# EAGLE design BelaCore (EAGLE 7.5.0)
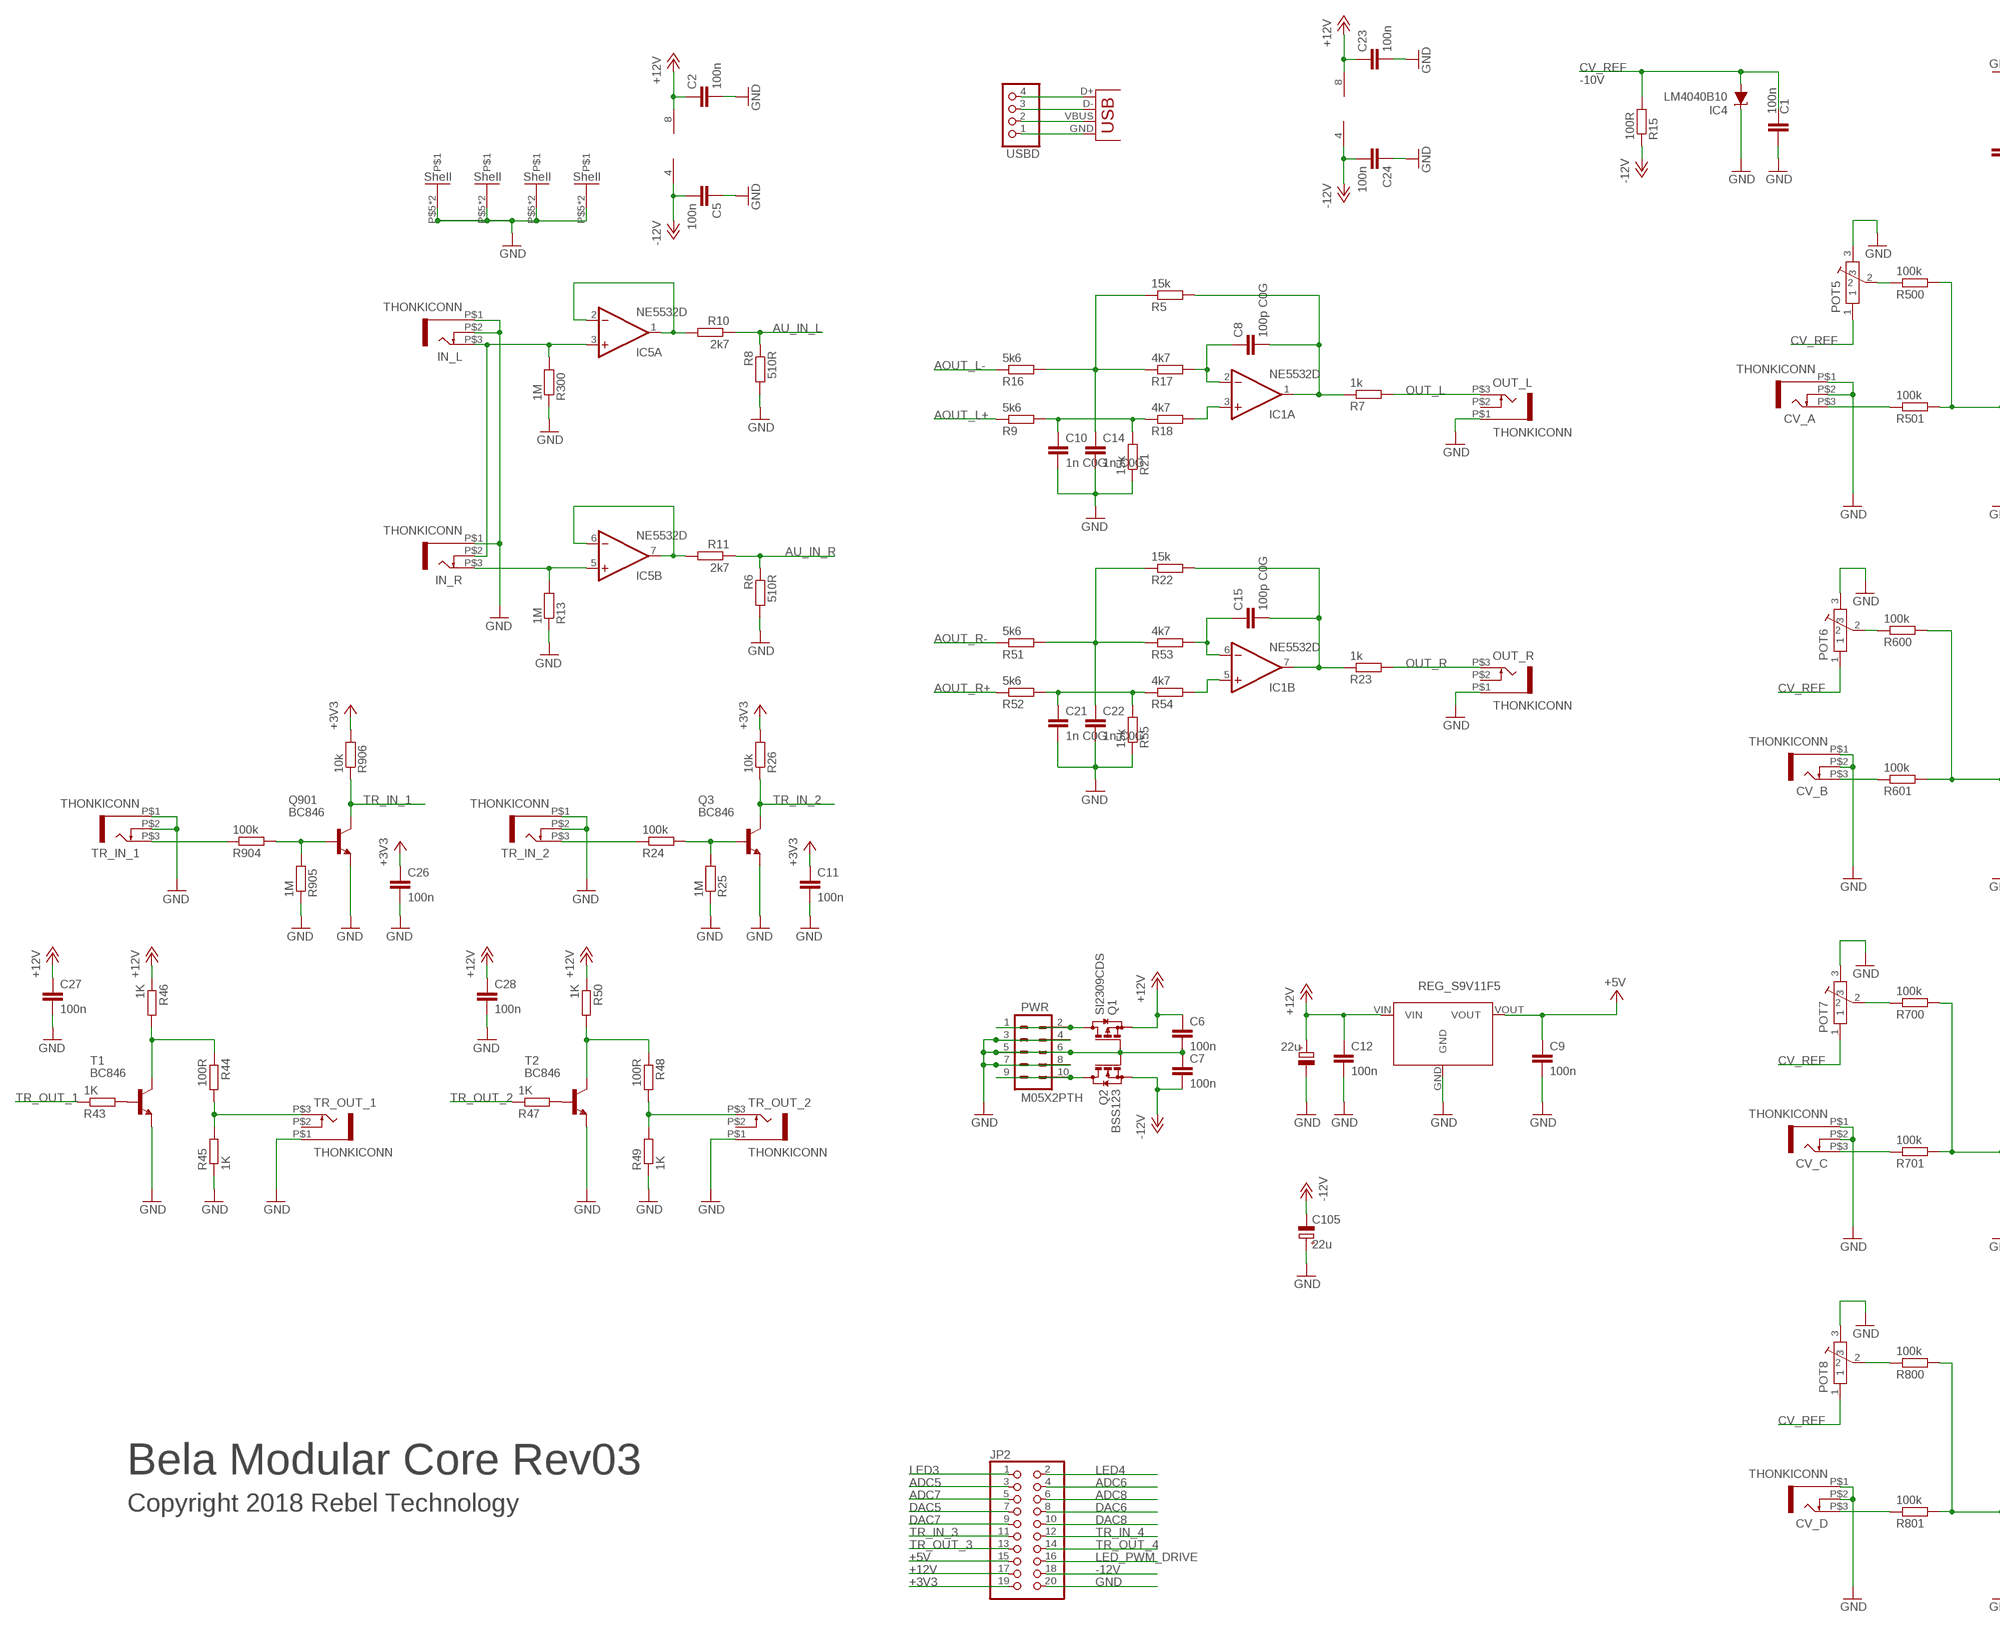
[diagram p0: schematic, sheet 1, part 1 of 2]
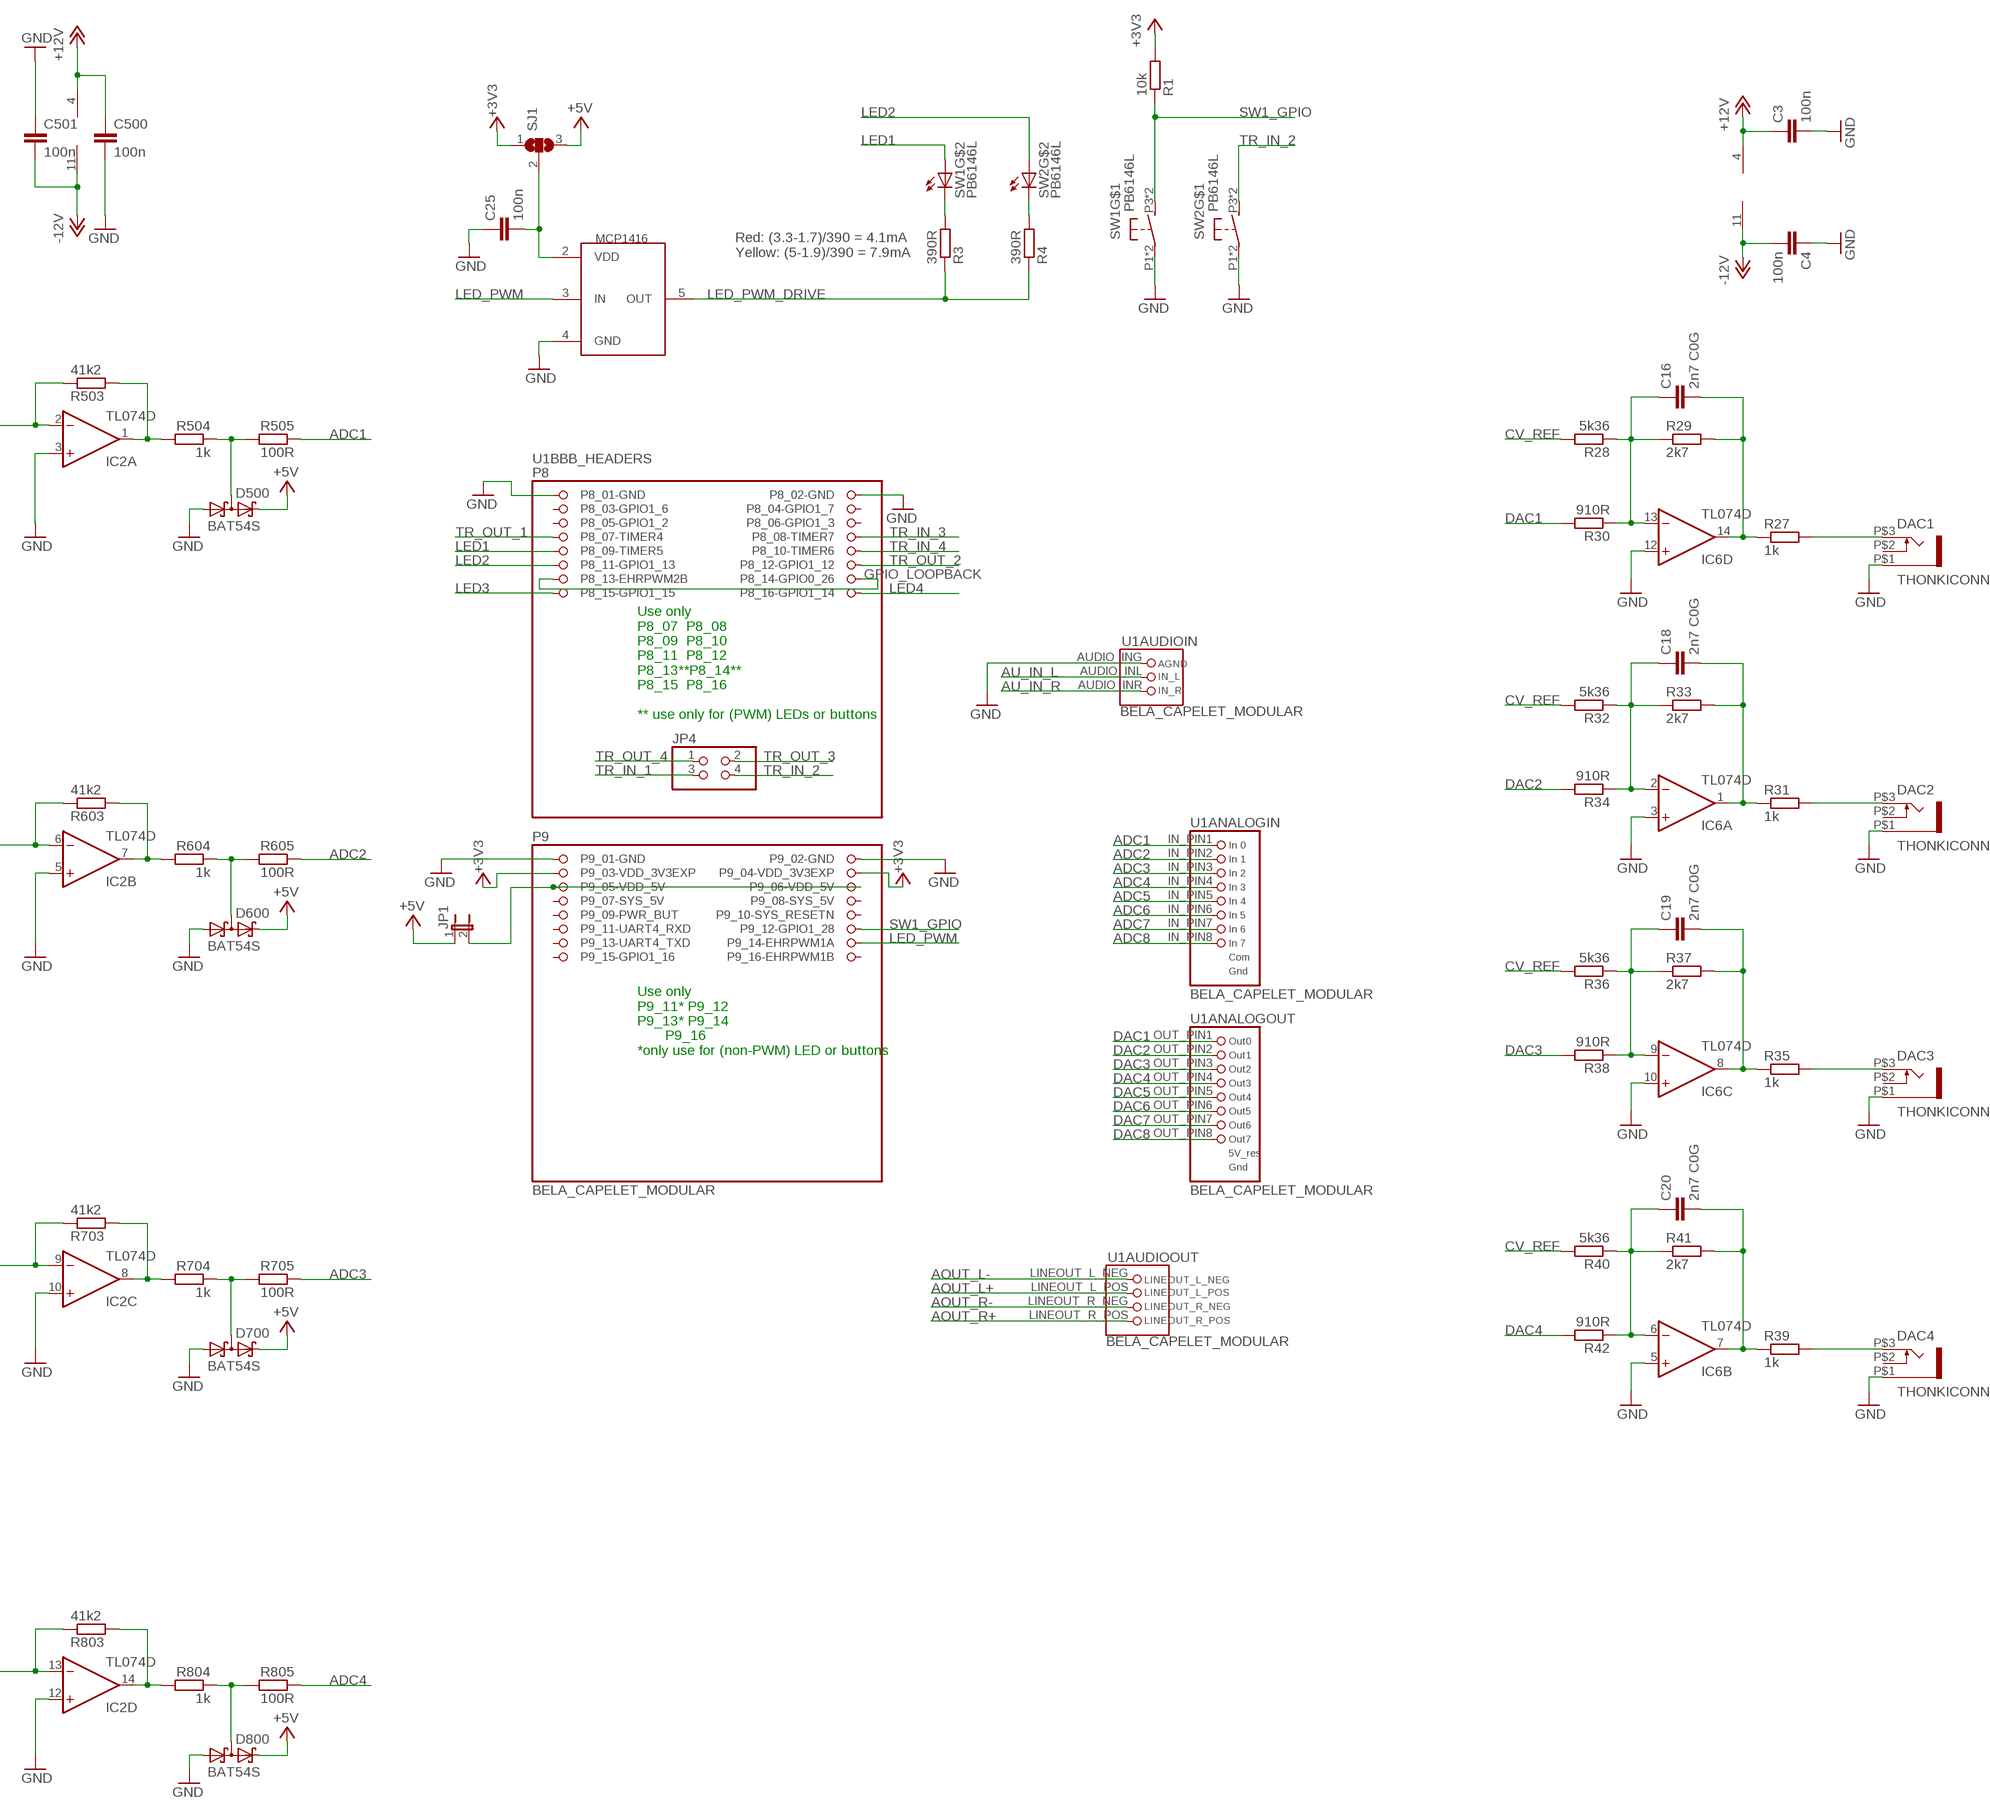
[diagram p1: schematic, sheet 1, part 2 of 2]

## Parts
C1  100n  C-EUC0603  [C0603]
C2  100n  C-EUC0603  [C0603]
C3  100n  C-EUC0603  [C0603]
C4  100n  C-EUC0603  [C0603]
C5  100n  C-EUC0603  [C0603]
C6  100n  C-EUC0603  [C0603]
C7  100n  C-EUC0603  [C0603]
C8  100p C0G  C-EUC0603  [C0603]
C9  100n  C-EUC0603  [C0603]
C10  1n C0G  C-EUC0603  [C0603]
C11  100n  C-EUC0603  [C0603]
C12  100n  C-EUC0603  [C0603]
C14  1n C0G  C-EUC0603  [C0603]
C15  100p C0G  C-EUC0603  [C0603]
C16  2n7 C0G  C-EUC0603  [C0603]
C17  22u  CPOL-EU153CLV-0505  [CPOL-5]
C18  2n7 C0G  C-EUC0603  [C0603]
C19  2n7 C0G  C-EUC0603  [C0603]
C20  2n7 C0G  C-EUC0603  [C0603]
C21  1n C0G  C-EUC0603  [C0603]
C22  1n C0G  C-EUC0603  [C0603]
C23  100n  C-EUC0603  [C0603]
C24  100n  C-EUC0603  [C0603]
C25  100n  C-EUC0603  [C0603]
C26  100n  C-EUC0603  [C0603]
C27  100n  C-EUC0603  [C0603]
C28  100n  C-EUC0603  [C0603]
C105  22u  CPOL-EU153CLV-0505  [CPOL-5]
C500  100n  C-EUC0603  [C0603]
C501  100n  C-EUC0603  [C0603]
CV_A  THONKICONN  [THONKICONN]
CV_B  THONKICONN  [THONKICONN]
CV_C  THONKICONN  [THONKICONN]
CV_D  THONKICONN  [THONKICONN]
D500  BAT54S  [SOT23]
D600  BAT54S  [SOT23]
D700  BAT54S  [SOT23]
D800  BAT54S  [SOT23]
DAC1  THONKICONN  [THONKICONN]
DAC2  THONKICONN  [THONKICONN]
DAC3  THONKICONN  [THONKICONN]
DAC4  THONKICONN  [THONKICONN]
IC1  NE5532D  [SO08]
IC2  TL074D  [SO14]
IC4  LM4040B10  LM4041C12DBZ  [DBZ_R-PDSO-G3]
IC5  NE5532D  [SO08]
IC6  TL074D  [SO14]
IN_L  THONKICONN  [THONKICONN]
IN_R  THONKICONN  [THONKICONN]
JP1  JUMPER-2PTH  [1X02]
JP2  PINHD-2X10  [2X10]
JP4  PINHD-2X02_2.54-SMD  [2X02SMD]
OUT_L  THONKICONN  [THONKICONN]
OUT_R  THONKICONN  [THONKICONN]
POT5  POT-ALPS-RK09L1140  [POT-ALPS-RK09L1140]
POT6  POT-ALPS-RK09L1140  [POT-ALPS-RK09L1140]
POT7  POT-ALPS-RK09L1140  [POT-ALPS-RK09L1140]
POT8  POT-ALPS-RK09L1140  [POT-ALPS-RK09L1140]
PWR  M05X2PTH  [AVR_ICSP]
Q1  SI2309CDS  BSS84  [SOT23]
Q2  BSS123  [SOT23]
Q3  BC846  [SOT23]
Q901  BC846  [SOT23]
R1  10k  R-EU_0603  [0603]
R3  390R  R-EU_0603  [0603]
R4  390R  R-EU_0603  [0603]
R5  15k  R-EU_0603  [0603]
R6  510R  R-EU_0603  [0603]
R7  1k  R-EU_0603  [0603]
R8  510R  R-EU_0603  [0603]
R9  5k6  R-EU_0603  [0603]
R10  2k7  R-EU_0603  [0603]
R11  2k7  R-EU_0603  [0603]
R13  1M  R-EU_0603  [0603]
R15  100R  R-EU_0603  [0603]
R16  5k6  R-EU_0603  [0603]
R17  4k7  R-EU_0603  [0603]
R18  4k7  R-EU_0603  [0603]
R21  15k  R-EU_0603  [0603]
R22  15k  R-EU_0603  [0603]
R23  1k  R-EU_0603  [0603]
R24  100k  R-EU_0603  [0603]
R25  1M  R-EU_0603  [0603]
R26  10k  R-EU_0603  [0603]
R27  1k  R-EU_0603  [0603]
R28  5k36  R-EU_0603  [0603]
R29  2k7  R-EU_0603  [0603]
R30  910R  R-EU_0603  [0603]
R31  1k  R-EU_0603  [0603]
R32  5k36  R-EU_0603  [0603]
R33  2k7  R-EU_0603  [0603]
R34  910R  R-EU_0603  [0603]
R35  1k  R-EU_0603  [0603]
R36  5k36  R-EU_0603  [0603]
R37  2k7  R-EU_0603  [0603]
R38  910R  R-EU_0603  [0603]
R39  1k  R-EU_0603  [0603]
R40  5k36  R-EU_0603  [0603]
R41  2k7  R-EU_0603  [0603]
R42  910R  R-EU_0603  [0603]
R43  1K  R-EU_0603  [0603]
R44  100R  R-EU_0603  [0603]
R45  1K  R-EU_0603  [0603]
R46  1K  R-EU_0603  [0603]
R47  1K  R-EU_0603  [0603]
R48  100R  R-EU_0603  [0603]
R49  1K  R-EU_0603  [0603]
R50  1K  R-EU_0603  [0603]
R51  5k6  R-EU_0603  [0603]
R52  5k6  R-EU_0603  [0603]
R53  4k7  R-EU_0603  [0603]
R54  4k7  R-EU_0603  [0603]
R55  15k  R-EU_0603  [0603]
R300  1M  R-EU_0603  [0603]
R500  100k  R-EU_0603  [0603]
R501  100k  R-EU_0603  [0603]
R503  41k2  R-EU_0603  [0603]
R504  1k  R-EU_0603  [0603]
R505  100R  R-EU_0603  [0603]
R600  100k  R-EU_0603  [0603]
R601  100k  R-EU_0603  [0603]
R603  41k2  R-EU_0603  [0603]
R604  1k  R-EU_0603  [0603]
R605  100R  R-EU_0603  [0603]
R700  100k  R-EU_0603  [0603]
R701  100k  R-EU_0603  [0603]
R703  41k2  R-EU_0603  [0603]
R704  1k  R-EU_0603  [0603]
R705  100R  R-EU_0603  [0603]
R800  100k  R-EU_0603  [0603]
R801  100k  R-EU_0603  [0603]
R803  41k2  R-EU_0603  [0603]
R804  1k  R-EU_0603  [0603]
R805  100R  R-EU_0603  [0603]
R904  100k  R-EU_0603  [0603]
R905  1M  R-EU_0603  [0603]
R906  10k  R-EU_0603  [0603]
SJ1  SJ2W  [SJ_2]
SW1  PB6146L  [PB6146L]
SW2  PB6146L  [PB6146L]
T1  BC846  [SOT23]
T2  BC846  [SOT23]
TR_IN_1  THONKICONN  [THONKICONN]
TR_IN_2  THONKICONN  [THONKICONN]
TR_OUT_1  THONKICONN  [THONKICONN]
TR_OUT_2  THONKICONN  [THONKICONN]
U1  BELA_CAPELET_MODULAR  [BELA_CAPELET_MODULAR]
U2  MCP1416  [SOT23-5]
U3  REG_S9V11F5  [REG_S9V11F5]
USBD  PINHD-1X4  [1X04]
X1  USBPTH-VERTICAL  [USB-B-PTH-VERTICAL]

## Nets
+3V3: C11.1 C26.1 JP2.19 R1.2 R26.2 R906.2 SJ1.1 U1.P9_03(BBB_HEADERS:P9_03-VDD_3V3EXP) U1.P9_04(BBB_HEADERS:P9_04-VDD_3V3EXP)
+5V: C9.1 D500.2(C2) D600.2(C2) D700.2(C2) D800.2(C2) JP1.1 JP2.15 SJ1.3 U3.VOUT
+12V: C2.1 C3.1 C6.1 C12.1 C17.+ C23.1 C27.1 C28.1 C500.1 IC1.8(P:V+) IC2.4(P:V+) IC5.8(P:V+) IC6.4(P:V+) JP2.17 Q1.2(S) R46.1 R50.1 U3.VIN
-12V: C4.2 C5.2 C7.2 C24.2 C105.- C501.2 IC1.4(P:V-) IC2.11(P:V-) IC5.4(P:V-) IC6.11(P:V-) JP2.18 Q2.2(S) R15.1
ADC1: R505.1 U1.IN_PIN1
ADC2: R605.1 U1.IN_PIN2
ADC3: R705.1 U1.IN_PIN3
ADC4: R805.1 U1.IN_PIN4
ADC5: JP2.3 U1.IN_PIN5
ADC6: JP2.4 U1.IN_PIN6
ADC7: JP2.5 U1.IN_PIN7
ADC8: JP2.6 U1.IN_PIN8
AOUT_L+: R9.1 U1.LINEOUT_L_POS
AOUT_L-: R16.1 U1.LINEOUT_L_NEG
AOUT_R+: R52.1 U1.LINEOUT_R_POS
AOUT_R-: R51.1 U1.LINEOUT_R_NEG
AU_IN_L: R8.1 R10.1 U1.AUDIO_INL
AU_IN_R: R6.1 R11.1 U1.AUDIO_INR
CV_REF: C1.1 IC4.2(A) POT5.1 POT6.1 POT7.1 POT8.1 R15.2 R28.2 R32.2 R36.2 R40.2
DAC1: R30.2 U1.OUT_PIN1
DAC2: R34.2 U1.OUT_PIN2
DAC3: R38.2 U1.OUT_PIN3
DAC4: R42.2 U1.OUT_PIN4
DAC5: JP2.7 U1.OUT_PIN5
DAC6: JP2.8 U1.OUT_PIN6
DAC7: JP2.9 U1.OUT_PIN7
DAC8: JP2.10 U1.OUT_PIN8
GND: C1.2 C2.2 C3.2 C4.1 C5.1 C6.2 C7.1 C9.2 C10.2 C11.2 C12.2 C14.2 C17.- C21.2 C22.2 C23.2 C24.1 C25.1 C26.2 C27.2 C28.2 C105.+ C500.2 C501.1 CV_A.P$1 CV_A.P$2 CV_B.P$1 CV_B.P$2 CV_C.P$1 CV_C.P$2 CV_D.P$1 CV_D.P$2 D500.1(A1) D600.1(A1) D700.1(A1) D800.1(A1) DAC1.P$1 DAC2.P$1 DAC3.P$1 DAC4.P$1 IC2.3(A:+IN) IC2.5(B:+IN) IC2.10(C:+IN) IC2.12(D:+IN) IC4.1(C) IC6.3(A:+IN) IC6.5(B:+IN) IC6.10(C:+IN) IC6.12(D:+IN) IN_L.P$1 IN_L.P$2 IN_R.P$1 JP2.20 OUT_L.P$1 OUT_R.P$1 POT5.3 POT5.P$5 POT5.P$6 POT6.3 POT6.P$5 POT6.P$6 POT7.3 POT7.P$5 POT7.P$6 POT8.3 POT8.P$5 POT8.P$6 PWR.3 PWR.4 PWR.5 PWR.6 PWR.7 PWR.8 Q1.1(G) Q2.1(G) Q3.2(E) Q901.2(E) R6.2 R8.2 R13.1 R21.1 R25.1 R45.1 R49.1 R55.1 R300.1 R905.1 SW1.P1(P) SW1.P2(P) SW2.P1(P) SW2.P2(P) T1.2(E) T2.2(E) TR_IN_1.P$1 TR_IN_1.P$2 TR_IN_2.P$1 TR_IN_2.P$2 TR_OUT_1.P$1 TR_OUT_2.P$1 U1.AUDIO_ING U1.P8_01(BBB_HEADERS:P8_01-GND) U1.P8_02(BBB_HEADERS:P8_02-GND) U1.P9_01(BBB_HEADERS:P9_01-GND) U1.P9_02(BBB_HEADERS:P9_02-GND) U2.4(GND) U3.GND
GPIO_LOOPBACK: U1.P8_13(BBB_HEADERS:P8_13-EHRPWM2B) U1.P8_14(BBB_HEADERS:P8_14-GPIO0_26)
IN_L: IC5.3(A:+IN) IN_L.P$3 IN_R.P$2 R300.2
LED1: SW1.PL1(A) U1.P8_09(BBB_HEADERS:P8_09-TIMER5)
LED2: SW2.PL1(A) U1.P8_11(BBB_HEADERS:P8_11-GPIO1_13)
LED3: JP2.1 U1.P8_15(BBB_HEADERS:P8_15-GPIO1_15)
LED4: JP2.2 U1.P8_16(BBB_HEADERS:P8_16-GPIO1_14)
LED_PWM: U1.P9_14(BBB_HEADERS:P9_14-EHRPWM1A) U2.3(IN)
LED_PWM_DRIVE: JP2.16 R3.1 R4.1 U2.5(OUT)
N$1: IC5.6(B:-IN) IC5.7(B:OUT) R11.2
N$2: IC5.1(A:OUT) IC5.2(A:-IN) R10.2
N$3: CV_A.P$3 R501.1
N$4: JP1.2 U1.P9_05(BBB_HEADERS:P9_05-VDD_5V) U1.P9_06(BBB_HEADERS:P9_06-VDD_5V)
N$5: R3.2 SW1.PL2(C)
N$6: IC2.9(C:-IN) R700.2 R701.2 R703.1
N$7: C25.2 SJ1.2 U2.2(VDD)
N$8: PWR.9 PWR.10 Q2.3(D)
N$9: R4.2 SW2.PL2(C)
N$10: C8.2 IC1.1(A:OUT) R5.2 R7.1
N$11: C8.1 IC1.2(A:-IN) R17.2
N$12: PWR.1 PWR.2 Q1.3(D)
N$13: IC2.2(A:-IN) R500.2 R501.2 R503.1
N$14: POT5.2 R500.1
N$15: IC1.3(A:+IN) R18.2
N$16: D500.3(C1A2) R504.1 R505.2
N$17: IC2.1(A:OUT) R503.2 R504.2
N$19: CV_B.P$3 R601.1
N$20: IC2.6(B:-IN) R600.2 R601.2 R603.1
N$21: POT6.2 R600.1
N$22: IC2.7(B:OUT) R603.2 R604.2
N$23: D600.3(C1A2) R604.1 R605.2
N$24: C10.1 R9.2 R18.1 R21.2
N$25: CV_C.P$3 R701.1
N$27: POT7.2 R700.1
N$28: IC2.8(C:OUT) R703.2 R704.2
N$29: D700.3(C1A2) R704.1 R705.2
N$30: C15.2 IC1.7(B:OUT) R22.2 R23.1
N$31: CV_D.P$3 R801.1
N$32: C22.1 R22.1 R51.2 R53.1
N$33: IC2.13(D:-IN) R800.2 R801.2 R803.1
N$34: POT8.2 R800.1
N$35: IC2.14(D:OUT) R803.2 R804.2
N$36: D800.3(C1A2) R804.1 R805.2
N$37: Q901.1(B) R904.2 R905.2
N$38: R43.2 T1.1(B)
N$40: C15.1 IC1.6(B:-IN) R53.2
N$41: C14.1 R5.1 R16.2 R17.1
N$42: IC1.5(B:+IN) R54.2
N$43: C21.1 R52.2 R54.1 R55.2
N$44: R44.1 R46.2 T1.3(C)
N$45: Q3.1(B) R24.2 R25.2
N$46: R904.1 TR_IN_1.P$3
N$47: R24.1 TR_IN_2.P$3
N$48: IC5.5(B:+IN) IN_R.P$3 R13.2
N$49: C16.2 IC6.14(D:OUT) R27.1 R29.2
N$50: C16.1 IC6.13(D:-IN) R28.1 R29.1 R30.1
N$51: DAC1.P$3 R27.2
N$52: C18.2 IC6.1(A:OUT) R31.1 R33.2
N$53: C18.1 IC6.2(A:-IN) R32.1 R33.1 R34.1
N$54: DAC2.P$3 R31.2
N$55: C19.2 IC6.8(C:OUT) R35.1 R37.2
N$56: C19.1 IC6.9(C:-IN) R36.1 R37.1 R38.1
N$57: DAC3.P$3 R35.2
N$58: C20.2 IC6.7(B:OUT) R39.1 R41.2
N$59: C20.1 IC6.6(B:-IN) R40.1 R41.1 R42.1
N$60: DAC4.P$3 R39.2
N$61: R44.2 R45.2 TR_OUT_1.P$3
N$62: R47.2 T2.1(B)
N$63: R48.1 R50.2 T2.3(C)
N$64: R48.2 R49.2 TR_OUT_2.P$3
N$65: USBD.4 X1.D+
N$66: USBD.1 X1.GND
N$67: USBD.2 X1.VBUS
N$68: USBD.3 X1.D-
OUT_L: OUT_L.P$3 R7.2
OUT_R: OUT_R.P$3 R23.2
SW1_GPIO: R1.1 SW1.P3(S) SW1.P4(S) U1.P9_12(BBB_HEADERS:P9_12-GPIO1_28)
TR_IN_1: JP4.3 Q901.3(C) R906.1
TR_IN_2: JP4.4 Q3.3(C) R26.1 SW2.P3(S) SW2.P4(S)
TR_IN_3: JP2.11 U1.P8_08(BBB_HEADERS:P8_08-TIMER7)
TR_IN_4: JP2.12 U1.P8_10(BBB_HEADERS:P8_10-TIMER6)
TR_OUT_1: R43.1 U1.P8_07(BBB_HEADERS:P8_07-TIMER4)
TR_OUT_2: R47.1 U1.P8_12(BBB_HEADERS:P8_12-GPIO1_12)
TR_OUT_3: JP2.13 JP4.2
TR_OUT_4: JP2.14 JP4.1
Unconnected: DAC1.P$2 DAC2.P$2 DAC3.P$2 DAC4.P$2 OUT_L.P$2 OUT_R.P$2 TR_OUT_1.P$2 TR_OUT_2.P$2 U1.P8_03(BBB_HEADERS:P8_03-GPIO1_6) U1.P8_04(BBB_HEADERS:P8_04-GPIO1_7) U1.P8_05(BBB_HEADERS:P8_05-GPIO1_2) U1.P8_06(BBB_HEADERS:P8_06-GPIO1_3) U1.P9_08(BBB_HEADERS:P9_08-SYS_5V) U1.P9_09(BBB_HEADERS:P9_09-PWR_BUT) U1.P9_10(BBB_HEADERS:P9_10-SYS_RESETN) U1.P9_11(BBB_HEADERS:P9_11-UART4_RXD) U1.P9_13(BBB_HEADERS:P9_13-UART4_TXD) U1.P9_15(BBB_HEADERS:P9_15-GPIO1_16) U1.P9_16(BBB_HEADERS:P9_16-EHRPWM1B)

## Notes on the sheet
- -10V
- Red: (3.3-1.7)/390 = 4.1mA
  Yellow: (5-1.9)/390 = 7.9mA
- Use only 
  P8_07  P8_08
  P8_09  P8_10
  P8_11  P8_12
  P8_13**P8_14**
  P8_15  P8_16
  
  ** use only for (PWM) LEDs or buttons
- Use only
  P9_11* P9_12
  P9_13* P9_14
         P9_16
  *only use for (non-PWM) LED or buttons
- Bela Modular Core Rev03
- Copyright 2018 Rebel Technology

## Power pins joined to a net without a drawn wire
P9_07-SYS_5V: U1.P9_07(BBB_HEADERS:P9_07-SYS_5V)

## Library data of the parts
C1-C8 C10 C11 C14 C15 C21-C24 C26-C28 C500 C501 = resistor:C-EU: CAPACITOR, European symbol
C9 C12 C16 C18-C20 C25 = Rebel:C-EU: CAPACITOR, European symbol
C17 C105 = Rebel:CPOL-EU: POLARIZED CAPACITOR, European symbol
CV_A CV_B CV_C CV_D DAC1-DAC4 IN_L IN_R OUT_L OUT_R TR_IN_1 TR_IN_2 TR_OUT_1 TR_OUT_2 = Rebel:THONKICONN
D500 D600 D700 D800 = diode:BAT54S: Schottky Diodes Pin connection corrected 2011-05-04 Source: Fairchild .. BAT54.pdf
IC1 IC5 = linear:NE5532: AUDIO AMPLIFIER
IC2 IC6 = linear:TL074: OP AMP
IC4 = texas:LM4041: PRECISION MICROPOWER SHUNT VOLTAGE REFERENCE Source: http://focus.ti.com/lit/ds/slcs146e/slcs146e.pdf; MF: TEXAS INSTRUMENT CONNECTORS; MPN: LM4041C12QDBZT; OC_FARNELL: 1771733; OC_NEWARK: 43K3376
JP1 = SparkFun-Retired:JUMPER-2: Jumper Basic 0.1" spaced jumper. Use with breakaway headers.
JP2 = pinhead:PINHD-2X10: PIN HEADER
JP4 = bela_capelet - Rebel Modified:PINHD-2X02: PIN HEADER
POT5-POT8 = Rebel:POT-ALPS-RK09L
PWR = SparkFun:M05X2: Header 5x2 Standard 10-pin dual row 0.1" header. Commonly used with AVR-ISP. Use with Spark Fun Electronics SKU: PRT-00778
Q1 = transistor-small-signal:BSS84: P-CHANNEL MOS FET; OC_FARNELL: 1779264
Q2 = transistor-small-signal:BSS123: N-CHANNEL MOS FET; OC_FARNELL: 1843725
Q3 Q901 T1 T2 = transistor:BC846: NPN TRANSISTOR
R1 R3-R11 R13 R15-R18 R21-R55 R300 R500 R501 R503-R505 R600 R601 R603-R605 R700 R701 R703-R705 R800 R801 R803-R805 R904-R906 = Rebel:R-EU_: RESISTOR, European symbol
SJ1 = jumper:SJ2W: SMD solder JUMPER
SW1 SW2 = Rebel:PB6146L
U1 = bela_capelet - Rebel Modified:BELA_CAPELET_MODULAR
U2 = Rebel:MCP1416
U3 = Rebel:REG_S9V11F5
USBD = pinhead:PINHD-1X4: PIN HEADER
X1 = SparkFun:USB: USB Connectors USB-B-PTH is fully proven SKU : PRT-00139 USB-miniB is fully proven SKU : PRT-00587 USB-A-PCB is untested. USB-A-H is throughly reviewed, but untested. Spark Fun Electronics SKU : PRT-00437 USB-B-SMT is throughly reviewed, but untested. Needs silkscreen touching up. USB-A-S has not been used/tested USB-MB-H has not been used/tested

## Net classes
1 power: width 0.178 mm, drill 0.305 mm, clearance 0.178 mm to class 0, clearance 0.178 mm

## Board
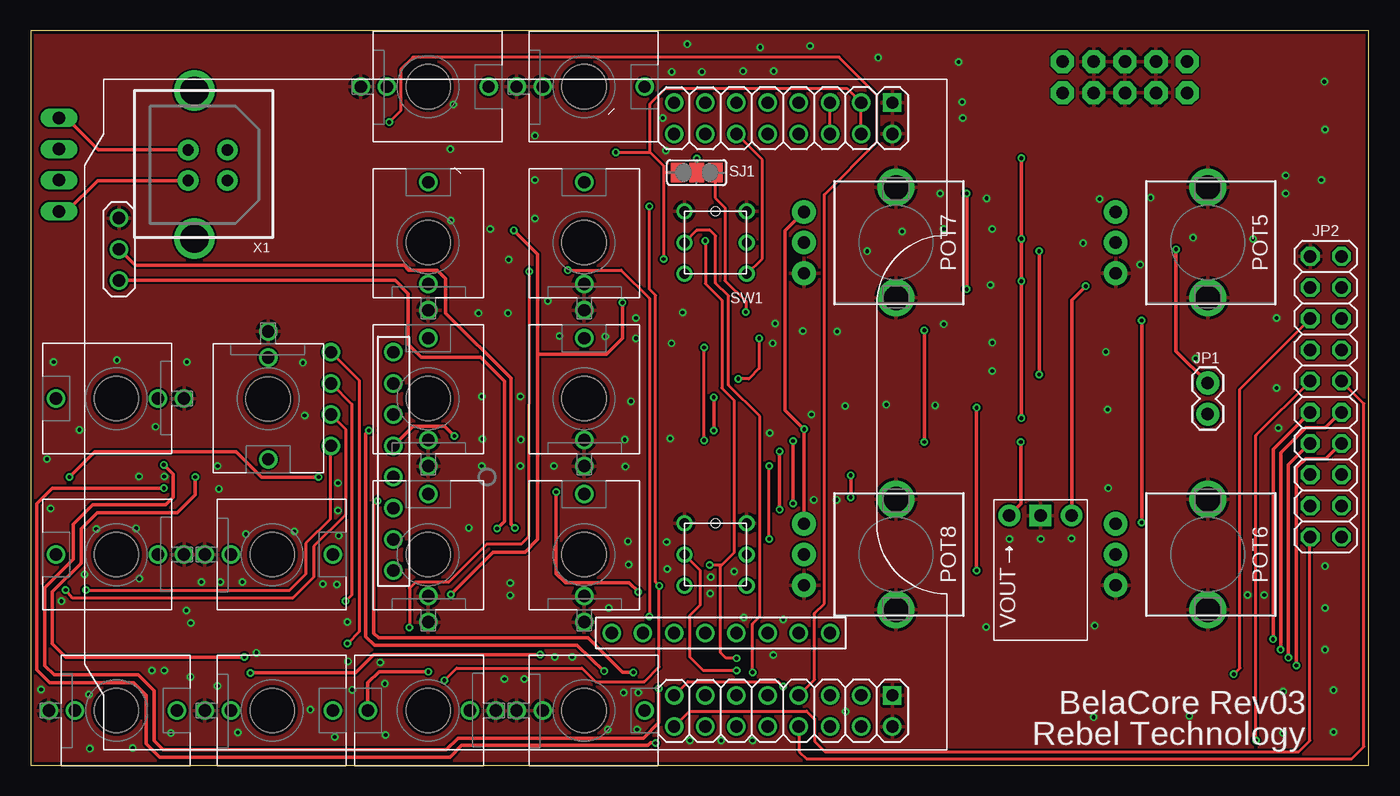
[diagram p2: board, top side]
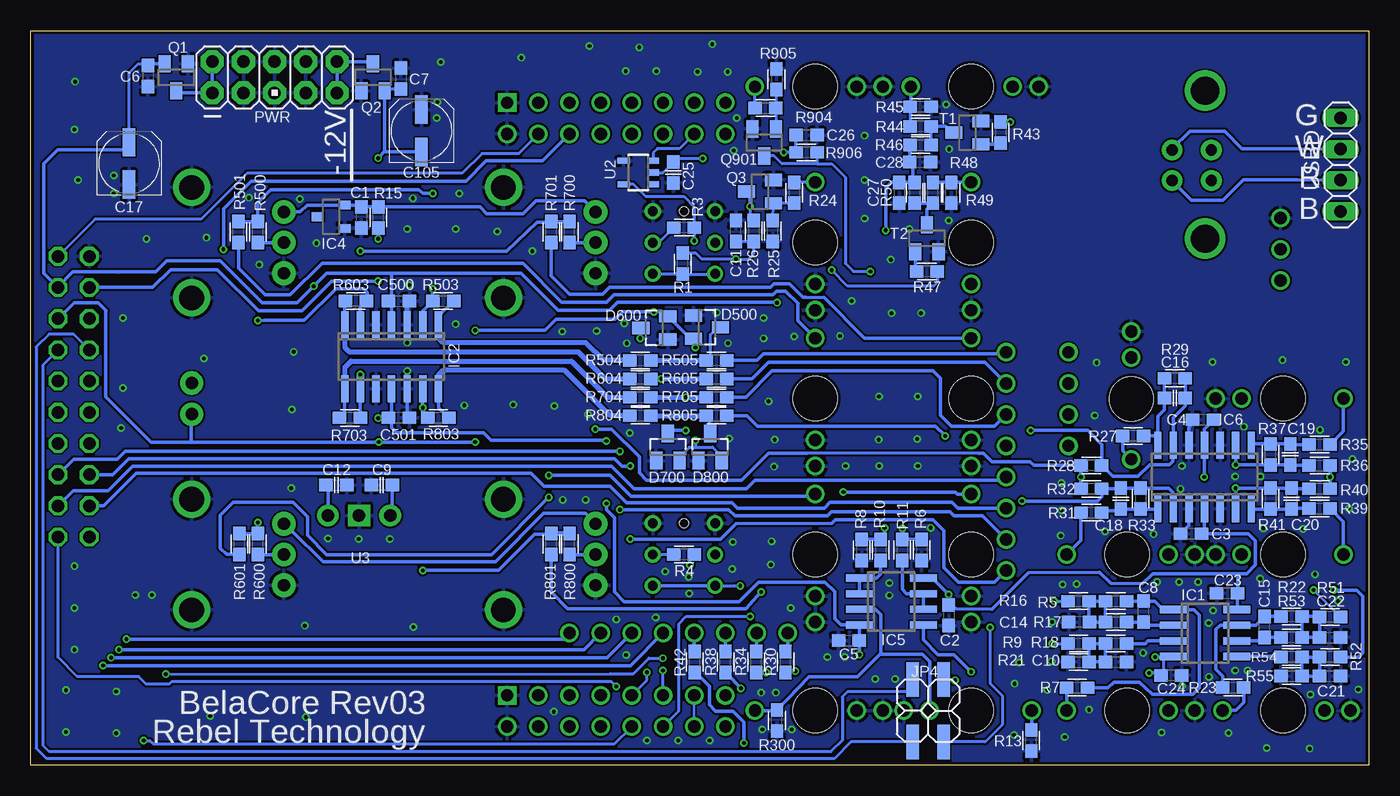
[diagram p3: board, bottom side, seen from below]

Size 109 x 59.8 mm. Coordinates in mm from the lower left corner, seen from the top.
Outline: 0,59.8 0,0 109,0 109,59.8 0,59.8
Copper layers (1*16): Top 0.035mm / dielectric 1.5mm / Bottom 0.035mm
Design rules "SeeedStudio_2layer_DRU_no_angle_20140221": minimum track width 6mil, minimum drill 12mil, track to track 6mil, track to pad 6mil, pad to pad 6mil, via to via 6mil, smd to smd 0mil, copper to edge 10mil, drill to drill 10mil, minimum pad ring 10mil, minimum via ring 6mil, stop-mask expansion 2mil, vias tented up to drill 100mil, thermal gap 10mil

### Footprints (pad centres in the part's own frame; a part is rotated, then mirrored left to right if it is on the bottom)
C0603 = smd 1.1 x 1: 1 -0.85,0; 2 0.85,0
CPOL-5 = smd 2.3 x 1: + 1.725,0; - -1.725,0
THONKICONN = drill 1: P$1 0,-5.5; P$2 0,-3.38; P$3 0,4.92 | hole 3.6: 0,0
SOT23 = smd 1 x 1.4: 1 -0.95,-1.1; 2 0.95,-1.1; 3 0,1.1
SO08 = smd 0.6 x 2.2: 1 -1.905,-2.6; 2 -0.635,-2.6; 3 0.635,-2.6; 4 1.905,-2.6; 5 1.905,2.6; 6 0.635,2.6; 7 -0.635,2.6; 8 -1.905,2.6
SO14 = smd 0.6 x 2.2: 1 -3.81,-2.6; 2 -2.54,-2.6; 3 -1.27,-2.6; 4 0,-2.6; 5 1.27,-2.6; 6 2.54,-2.6; 7 3.81,-2.6; 8 3.81,2.6; 9 2.54,2.6; 10 1.27,2.6; 11 0,2.6; 12 -1.27,2.6; 13 -2.54,2.6; 14 -3.81,2.6
DBZ_R-PDSO-G3 = smd 0.7 x 1: 1 -0.95,-1.1; 2 0.95,-1.1; 3 0,1.1
1X02 = drill 1.016 pad 1.88: 1 0,0; 2 2.54,0
2X10 = drill 1.016 octagon: 1 -11.43,-1.27; 2 -11.43,1.27; 3 -8.89,-1.27; 4 -8.89,1.27; 5 -6.35,-1.27; 6 -6.35,1.27; 7 -3.81,-1.27; 8 -3.81,1.27; 9 -1.27,-1.27; 10 -1.27,1.27; 11 1.27,-1.27; 12 1.27,1.27; 13 3.81,-1.27; 14 3.81,1.27; 15 6.35,-1.27; 16 6.35,1.27; 17 8.89,-1.27; 18 8.89,1.27; 19 11.43,-1.27; 20 11.43,1.27
2X02SMD = smd 1.016 x 2.794: 1 -1.27,-3.81; 2 -1.27,1.27; 3 1.27,-3.81; 4 1.27,1.27
POT-ALPS-RK09L1140 = drill 1 pad 1.93: 1 -2.5,-7.5; 2 0,-7.5; 3 2.5,-7.5 | drill 2: P$5 -4.5,0; P$6 4.5,0
AVR_ICSP = drill 1.016 pad 1.88 octagon: 1 -1.27,5.08; 2 1.27,5.08; 3 -1.27,2.54; 4 1.27,2.54; 5 -1.27,0; 6 1.27,0; 7 -1.27,-2.54; 8 1.27,-2.54; 9 -1.27,-5.08; 10 1.27,-5.08
0603 = smd 1.1 x 1: 1 -0.85,0; 2 0.85,0
SJ_2 = smd 1.168 x 1.6: 1 -1.524,0; 2 0,0; 3 1.524,0
PB6146L = drill 0.8: P1 -2.54,2.54; P2 2.54,2.54; P3 -2.54,-2.54; P4 2.54,-2.54; PL1 -2.54,0; PL2 2.54,0 | hole 0.7: 0,2.54
BELA_CAPELET_MODULAR = drill 1: AUDIO_ING 16.002,31.242; AUDIO_INL 13.462,31.242; AUDIO_INR 10.922,31.242; IN_PIN1 5.08,8.89; IN_PIN2 2.54,8.89; IN_PIN3 0,8.89; IN_PIN4 -2.54,8.89; IN_PIN5 -5.08,8.89; IN_PIN6 -7.62,8.89; IN_PIN7 -10.16,8.89; IN_PIN8 -12.7,8.89; LINEOUT_L_NEG 2.54,13.97; LINEOUT_L_POS 5.08,13.97; LINEOUT_R_NEG -2.54,13.97; LINEOUT_R_POS 0,13.97; OUT_PIN1 -17.78,-8.89; OUT_PIN2 -17.78,-11.43; OUT_PIN3 -17.78,-13.97; OUT_PIN4 -17.78,-16.51; OUT_PIN5 -17.78,-19.05; OUT_PIN6 -17.78,-21.59; OUT_PIN7 -17.78,-24.13; OUT_PIN8 -17.78,-26.67; P8_02 -25.4,-31.75; P8_03 -22.86,-29.21; P8_04 -25.4,-29.21; P8_05 -22.86,-26.67; P8_06 -25.4,-26.67; P8_07 -22.86,-24.13; P8_08 -25.4,-24.13; P8_09 -22.86,-21.59; P8_10 -25.4,-21.59; P8_11 -22.86,-19.05; P8_12 -25.4,-19.05; P8_13 -22.86,-16.51; P8_14 -25.4,-16.51; P8_15 -22.86,-13.97; P8_16 -25.4,-13.97; P9_02 22.86,-31.75; P9_03 25.4,-29.21; P9_04 22.86,-29.21; P9_05 25.4,-26.67; P9_06 22.86,-26.67; P9_07 25.4,-24.13; P9_08 22.86,-24.13; P9_09 25.4,-21.59; P9_10 22.86,-21.59; P9_11 25.4,-19.05; P9_12 22.86,-19.05; P9_13 25.4,-16.51; P9_14 22.86,-16.51; P9_15 25.4,-13.97; P9_16 22.86,-13.97 | drill 1 square: P8_01 -22.86,-31.75; P9_01 25.4,-31.75
SOT23-5 = smd 0.5 x 1: 1 -0.95,-1.2; 2 0,-1.2; 3 0.95,-1.2; 4 0.95,1.2; 5 -0.95,1.2
REG_S9V11F5 = drill 1.016 pad 1.778 square: GND 0,0 | drill 1.016 pad 1.778: VIN -2.54,0; VOUT 2.54,0
1X04 = drill 1.016 long: 1 -3.81,0; 2 -1.27,0; 3 1.27,0; 4 3.81,0
USB-B-PTH-VERTICAL = drill 0.914 pad 1.676: D+ -1.194,-0.508; D- -1.194,2.692; GND 1.295,-0.508; VBUS 1.295,2.692 | drill 2.286: P$1 -6.02,0; P$2 6.02,0

### Placement (x,y rotation side)
C1  82.07,44.6 270 bottom
C2  34.22,12.2 270 bottom
C3  14.49,18.83 180 bottom
C4  13.51,28.12 0 bottom
C5  42.35,10.14 0 bottom
C6  99.45,56.1 270 bottom
C7  78.85,55.9 270 bottom
C8  18.35,12.5 90 bottom
C9  80.4,22.8 180 bottom
C10  20.6,8.4 0 bottom
C11  51.55,43.5 90 bottom
C12  84.1,22.8 0 bottom
C14  23.6,11.65 180 bottom
C15  8.5,11.25 90 bottom
C16  15.8,29.9 180 bottom
C17  100.99,49 90 bottom
C18  20.2,21.7 270 bottom
C19  6.4,25.3 90 bottom
C20  6.3,21.7 270 bottom
C21  3.15,7.25 0 bottom
C22  3.15,10.4 0 bottom
C23  11.54,13.99 180 bottom
C24  16.09,7.3 180 bottom
C25  56.65,48.25 90 bottom
C26  45.8,51.3 0 bottom
C27  38.25,46.6 270 bottom
C28  36.55,49.1 0 bottom
C105  77.17,51.65 90 bottom
C500  79,37.78 0 bottom
C501  79,28.28 180 bottom
CV_A  45.09,29.84 0 top
CV_B  45.09,17.14 0 top
CV_C  32.38,29.84 0 top
CV_D  32.38,17.14 0 top
D500  53.9,35.66 270 bottom
D600  58.2,35.6 90 bottom
D700  57.1,25.9 0 bottom
D800  53.65,25.9 0 bottom
DAC1  19.34,29.82 180 top
DAC2  19.68,17.14 270 top
DAC3  6.99,29.84 90 top
DAC4  6.99,17.14 90 top
IC1  13.34,10.75 270 bottom
IC2  79.61,33.26 180 bottom
IC4  84.52,44.65 90 bottom
IC5  38.9,13.32 270 bottom
IC6  13.38,23.46 0 bottom
IN_L  45.09,4.45 270 top
IN_R  32.38,4.45 90 top
JP1  95.89,28.57 90 top
JP2  105.5,30 90 top
JP4  35.9,5.7 0 bottom
OUT_L  19.68,4.45 270 top
OUT_R  6.99,4.45 270 top
POT5  95.89,42.55 270 top
POT6  95.89,17.14 270 top
POT7  70.48,42.55 270 top
POT8  70.48,17.14 270 top
PWR  89.13,56.01 90 bottom
Q1  97.14,56 180 bottom
Q2  81.12,56 0 bottom
Q3  49.6,46.7 90 bottom
Q901  49.25,50.7 180 bottom
R1  55.88,40.83 90 bottom
R3  55.78,43.76 180 bottom
R4  55.78,17.14 180 bottom
R5  20.6,13.35 0 bottom
R6  36.43,17.52 270 bottom
R7  23.75,6.3 180 bottom
R8  41.3,17.52 270 bottom
R9  23.65,9.9 0 bottom
R10  39.77,17.52 270 bottom
R11  38,17.52 270 bottom
R13  27.49,2 90 bottom
R15  80.67,44.6 90 bottom
R16  23.65,13.35 0 bottom
R17  20.6,11.65 0 bottom
R18  20.6,9.9 0 bottom
R21  23.65,8.4 0 bottom
R22  6.3,12.1 180 bottom
R23  11.05,6.31 0 bottom
R24  46.8,46.6 270 bottom
R25  48.55,43.5 90 bottom
R26  50.1,43.5 270 bottom
R27  19.2,26.8 180 bottom
R28  22.6,24.4 180 bottom
R29  15.8,31.5 180 bottom
R30  47.51,8.39 90 bottom
R31  22.6,20.55 180 bottom
R32  22.6,22.5 180 bottom
R33  18.6,21.7 270 bottom
R34  49.9,8.4 90 bottom
R35  4,26.1 0 bottom
R36  4,24.4 0 bottom
R37  8,25.3 90 bottom
R38  52.4,8.4 90 bottom
R39  4,20.9 0 bottom
R40  4,22.5 0 bottom
R41  8,21.7 270 bottom
R42  54.9,8.4 90 bottom
R43  30,51.5 270 bottom
R44  36.5,52 180 bottom
R45  36.5,53.6 180 bottom
R46  36.5,50.5 0 bottom
R47  36,40.2 180 bottom
R48  35.5,46.6 90 bottom
R49  34,46.6 90 bottom
R50  37,46.6 270 bottom
R51  3.15,12.05 180 bottom
R52  3.15,8.8 180 bottom
R53  6.3,10.4 180 bottom
R54  6.3,8.8 180 bottom
R55  6.3,7.25 0 bottom
R300  48.21,3.63 90 bottom
R500  90.5,43.4 90 bottom
R501  92.07,43.4 90 bottom
R503  75.4,37.78 0 bottom
R504  59.34,32.95 180 bottom
R505  53.14,32.95 180 bottom
R600  90.5,18 90 bottom
R601  92,18 90 bottom
R603  82.5,37.78 180 bottom
R604  59.34,31.45 180 bottom
R605  53.14,31.45 180 bottom
R700  65.1,43.4 90 bottom
R701  66.6,43.4 90 bottom
R703  83,28.28 180 bottom
R704  59.34,29.95 180 bottom
R705  53.14,29.95 180 bottom
R800  65.1,18 90 bottom
R801  66.6,18 90 bottom
R803  75.8,28.28 0 bottom
R804  59.34,28.45 180 bottom
R805  53.14,28.45 180 bottom
R904  49.15,53.5 0 bottom
R905  48.25,55.85 270 bottom
R906  45.8,49.9 180 bottom
SJ1  54.25,48.25 0 top
SW1  55.78,42.55 0 top
SW2  55.78,17.14 0 top
T1  32.7,51.5 90 bottom
T2  36,42.9 0 bottom
TR_IN_1  45.09,55.24 270 top
TR_IN_2  45.09,42.55 0 top
TR_OUT_1  32.38,55.24 270 top
TR_OUT_2  32.38,42.55 0 top
U1  38.44,28.54 90 top
U2  59.5,48.25 90 bottom
U3  82.25,20.32 180 top
USBD  2.3,48.9 90 bottom
X1  13.34,48.9 270 top

### Tracks (layer width: path | path; a pad name or v marks a point on that pad's centre or on a via)
+3V3  (via drill 0.3)
  Top 0.254: U1.P9_04 U1.P9_03 66.49,55.1 51.7,55.1 50.45,53.85 50.45,49.9 | v47.65,49.9 50.45,49.9 | 51.55,48.25 51.55,48.8 50.45,49.9 | 51.55,48.25 v51.55,41.2 | SJ1.1 51.55,48.25
  Bottom 0.254: R1.2 55.86,41.66 54.79,41.66 54.33,41.2 v51.55,41.2 50.55,41.2 50.1,41.65 R26.2 | U1.P9_04 69.25,49.8 72.25,49.8 73.85,48.2 91.35,48.2 95.1,44.45 103.75,44.45 JP2.19 | 50.45,42.6 51.55,42.6 C11.1 | R906.2 C26.1
  Bottom 0.305: v47.65,49.9 R906.2 | 50.45,42.6 R26.2
+5V  (via drill 0.3)
  Top 0.254: SJ1.3 55.75,47.72 55.75,46.2 56.55,45.4 56.55,39.45 58.25,37.75 v58.25,36.9 | v54.85,26.45 v54.85,34
  Top 0.305: v80.65,26.3 80.65,21.26 U3.VOUT | v72.8,35.4 v72.8,26.3
  Bottom 0.254: 55.26,34.71 D500.2 54.85,34.56 v54.85,34 | 54.85,25.9 55.35,25.9 56.05,25.2 D700.2 | 54.85,25.9 53.45,25.9 52.7,25.15 D800.2 | v54.85,26.45 54.85,25.9 | 57.45,36.9 v58.25,36.9 | 57.65,36.2 57.65,36.4 D600.2
  Bottom 0.305: C9.1 79.55,20.78 U3.VOUT | JP2.15 105.47,37.65 103.5,37.65 102.85,37 102.9,36.95 102.9,30 99.2,26.3 95.85,26.3 | JP1.1 95.91,28.55 95.91,26.36 95.85,26.3 | 95.85,26.3 v80.65,26.3 v72.8,26.3 | v58.25,36.9 60.8,36.9 61.4,36.3 66.2,36.3 67.1,35.4 v72.8,35.4 | 55.26,34.71 D600.2 57.45,36.9
+12V  (via drill 0.3)
  Top 0.305: v48.2,37.65 48.2,34.75 46.9,33.45 41.3,33.45 | 41.3,33.45 41.3,18.37 40.25,17.32 37.65,17.32 v34.22,13.89 | 41.3,33.45 41.3,41.6 v39.35,43.55 | v85.95,39 84.8,37.85 84.8,21.75 U3.VIN
  Bottom 0.254: JP2.17 106.77,38.96 | 30.7,12.7 33.55,12.7 C2.1 | C17.+ 100.99,56.36 100.25,57.1 99.65,57.1 | C6.1 99.6,57.1
  Bottom 0.305: IC6.4 13.38,19.09 C3.1 9.83,18.83 9.25,18.25 9.25,16.3 9.95,15.6 10.69,15.6 | IC2.4 79.61,37.54 C500.1 79.61,38.02 79.61,40.04 | 79.61,40.04 78.85,40.05 69.05,40.05 66.05,37.05 61.85,37.05 61.2,37.7 48.2,37.7 v48.2,37.65 | 79.61,40.04 84.91,40.04 v85.95,39 87.3,37.65 90.15,37.65 93.58,41.08 97.92,41.08 98.84,40.15 101.85,40.15 | 10.69,15.6 17.6,15.6 18.45,14.75 21,14.8 21.95,15.7 27.75,15.65 30.7,12.7 | 106.77,38.96 105.58,40.15 101.85,40.15 | C2.1 v34.22,13.89 35.55,15.22 IC5.8 | IC1.8 C23.1 10.69,15.6 | 99.65,57.1 99.6,57.1 Q1.2 | 101.31,51.05 C17.+ 100.95,50.69 100.95,50.1 106.8,50.1 107.95,48.95 107.95,40.07 JP2.17 | 101.85,40.15 | C12.1 84.79,22.64 U3.VIN | R50.1 C27.1 38.9,47.45 39.35,47 v39.35,43.55 | R46.1 37.4,50.45 C28.1 37.15,49.1 37.15,47.5 37,47.5
  Bottom 0.406: 79.8,37.73 C500.1 | 37,47.5 R50.1
-12V  (via drill 0.3)
  Top 0.305: v80.7,28.25 v80.7,39.4 v80.7,42.85 v80.7,49.42 | v62.1,26.4 v62.1,21.3 | v41.5,8.99 v41.49,9 27.95,9 26.45,7.5 v17.9,7.5 | v13.4,23.45 13.4,22 11.95,20.55 5.4,20.55 4.1,19.25 4.1,16.45 1.75,14.1 1.75,9.9 2.85,8.8 v17.4,8.8
  Bottom 0.254: C24.2 16.7,7.74 16.7,8.8 16.66,8.85 IC1.4 | C105.- 77.24,49.95 | C7.2 80.02,55.05 Q2.2
  Bottom 0.305: IC6.11 13.38,27.34 C4.2 | IC2.11 79.61,28.52 | 79.61,28.52 C501.2 79.88,28.25 v80.7,28.25 | v80.7,42.85 80.7,43.72 R15.1 | v80.7,39.4 84.5,39.4 86.9,37 90.45,37 93.8,40.35 97.59,40.35 99.05,38.89 JP2.18 | 79.61,28.52 79.61,27.45 79.21,27.05 72.1,27.05 71.5,26.45 62.15,26.45 v62.1,26.4 | 13.4,26.04 IC6.11 | v62.1,21.3 62.1,20.8 61.45,20.15 61.45,14.1 60.65,13.3 51.3,13.3 49.7,14.9 44.3,14.9 43.5,14.1 43.5,11.92 42.99,11.41 IC5.4 C5.2 v41.5,8.99 | Q2.2 80.15,54.88 80.15,49.97 | 80.15,49.97 80.15,49.95 77.24,49.95 | 80.15,49.97 v80.7,49.42 | C24.2 16.95,7.45 16.95,7.5 v17.9,7.5 | IC6.11 13.38,23.47 v13.4,23.45 | v17.4,8.8 16.7,8.8
  Bottom 0.406: 12.53,28.25 C4.2
ADC1
  Bottom 0.305: R505.1 49.85,32.95 49.3,33.5 29.67,33.5 U1.IN_PIN1
ADC2
  Bottom 0.305: U1.IN_PIN2 31.27,32.8 48.9,32.8 50.25,31.45 R605.1
ADC3
  Bottom 0.305: U1.IN_PIN3 30.49,27.6 34,27.6 34.9,28.5 34.9,31.5 35.5,32.1 48.6,32.1 50.75,29.95 R705.1
ADC4  (via drill 0.3)
  Top 0.305: v34.5,26.8 33.7,27.6 31.15,27.6 U1.IN_PIN4
  Bottom 0.305: R805.1 50.65,28.45 49.8,27.6 35.3,27.6 v34.5,26.8
ADC5
  Bottom 0.305: JP2.3 105.53,22.35 102.7,22.35 100.7,24.35 61.69,24.35 59.85,22.51 50.7,22.5 50,23.2 29.81,23.2 U1.IN_PIN5
ADC6
  Bottom 0.305: JP2.4 103.04,21.11 100.4,23.75 68.25,23.75 67.2,22.7 61.8,22.7 60.45,21.35 51.87,21.35 51.44,20.92 50.83,20.93 44.36,20.93 43.89,21.4 33.96,21.4 33.48,20.92 U1.IN_PIN6
ADC7  (via drill 0.3)
  Top 0.305: v61,25.55 v61,20.8
  Bottom 0.305: JP2.5 106.75,23.65 105.5,24.9 101.95,24.9 101.3,25.55 v61,25.55 | v61,20.8 52.15,20.8 51.65,20.3 44.1,20.3 43.76,20.64 34.12,20.64 33.78,20.3 31.47,20.3 U1.IN_PIN7
ADC8  (via drill 0.3)
  Top 0.254: v60.15,18.4 v60.15,24.35
  Bottom 0.305: JP2.6 102.3,23.65 101,24.95 61.45,24.95 60.85,24.35 v60.15,24.35 | U1.IN_PIN8 30.5,14.9 33.44,14.9 34.62,16.08 34.61,19.1 35.49,19.98 43.45,19.98 43.73,19.7 51.55,19.65 52.8,18.4 v60.15,18.4
AOUT_L+  (via drill 0.3)
  Top 0.254: U1.LINEOUT_L_POS 26.75,31.34 26.75,10.85 v25.8,9.9
  Bottom 0.254: v25.8,9.9 R9.1
AOUT_L-  (via drill 0.3)
  Top 0.254: U1.LINEOUT_L_NEG 26.15,29.4 26.15,13.85 v25.65,13.35
  Bottom 0.254: v25.65,13.35 R16.1
AOUT_R+  (via drill 0.3)
  Top 0.254: U1.LINEOUT_R_POS 25.65,27.36 25.65,20.4 23.05,17.8 23.05,15.3 21.35,13.6 3.4,13.6 v2.85,14.25
  Bottom 0.305: R52.1 0.85,8.8 0.5,9.15 0.5,13.75 1,14.25 v2.85,14.25
AOUT_R-  (via drill 0.3)
  Top 0.254: v4.5,14.25 21.1,14.25 22.4,15.55 22.4,18.05 24.42,20.07 24.42,25.95 U1.LINEOUT_R_NEG
  Bottom 0.254: v4.5,14.25 R51.1
AU_IN_L  (via drill 0.3)
  Top 0.305: v39.45,19.31 39.15,19.61 39.15,31.5 33.8,36.8 33.8,39.6 33.1,40.3 30.8,40.3 30.4,40.7 8.5,40.7 U1.AUDIO_INL
  Bottom 0.305: R8.1 R10.1 | 39.8,18.4 R10.1 | v39.45,19.31 39.45,18.49 R10.1
AU_IN_R  (via drill 0.3)
  Top 0.305: U1.AUDIO_INR 29.69,39.46 30.75,38.4 30.75,34.25 31.8,33.2 36.65,33.2 38.6,31.25 38.59,19.86 v37.99,19.26
  Bottom 0.305: R6.1 R11.1 v37.99,19.26
CV_REF  (via drill 0.3)
  Top 0.305: POT8.1 62.98,27.34 v63,27.35 61.45,28.9 61.45,43.51 POT7.1 | v23.45,23.45 18.8,23.45 16.75,25.5 5.2,25.5 v3.15,23.45
  Bottom 0.254: 31.8,25.4 45.75,25.4
  Bottom 0.305: POT5.1 87.05,45.05 86.5,45.6 IC4.2 82.22,45.6 C1.1 R15.2 72.4,45.45 71.85,44.9 68.9,44.9 67.85,45.95 63.9,45.95 62.99,45.05 POT7.1 | POT8.1 62.98,19.68 63.8,20.5 67.21,20.5 71.15,16.56 85.19,16.56 87.73,19.1 88.28,19.64 POT6.1 | R40.2 v3.15,23.45 R36.2 | R32.2 v23.45,23.45 R28.2 27.3,24.4 27.6,24.7 30.7,24.7 31.4,25.4 31.8,25.4 | v63,27.35 61.7,27.35 59.4,25.1 59.4,23.8 58.85,23.2 51.1,23.2 48.9,25.4 45.75,25.4
DAC1
  Bottom 0.305: U1.OUT_PIN1 47.33,9.28 R30.2
DAC2
  Bottom 0.305: U1.OUT_PIN2 49.87,9.28 R34.2
DAC3
  Bottom 0.305: U1.OUT_PIN3 R38.2
DAC4
  Bottom 0.305: U1.OUT_PIN4 54.95,9.3 R42.2
DAC5  (via drill 0.3)
  Top 0.305: JP2.7 106.74,26.19 105.5,24.95 103.85,24.95 103.1,24.2 v103.1,8.1
  Bottom 0.305: U1.OUT_PIN5 60.15,8.1 v103.1,8.1
DAC6  (via drill 0.3)
  Top 0.305: JP2.8 104.19,26.19 102.45,24.45 v102.45,8.75
  Bottom 0.305: U1.OUT_PIN6 62.04,8.75 v102.45,8.75
DAC7  (via drill 0.3)
  Top 0.305: JP2.9 106.73,28.73 105.45,27.45 103.85,27.45 101.85,25.45 101.85,9.45 arc-90 v101.8,9.4
  Bottom 0.305: U1.OUT_PIN7 63.93,9.4 v101.8,9.4
DAC8  (via drill 0.3)
  Top 0.305: JP2.10 101.2,25.7 v101.2,10.25
  Bottom 0.305: U1.OUT_PIN8 65.62,10.25 v101.2,10.25
GND  (via drill 0.3)
  Bottom 0.254: R25.1 48.5,42.58
  Bottom 0.305: IC2.12 78.34,28.47 C501.1 | IC6.12 14.65,27.41 C4.1 | IC6.3 14.65,19.52 C3.2
  Bottom 0.406: IC2.3 78.34,37.59 C500.2 | IC2.12 v78.34,32.09 v78.33,32.1
  other vias: 0.85,6.15 53.1,36.85 42.7,8.8 39.05,14.82 39.05,13.82 12.69,12.58 17.53,18.8 10.88,23.5 8.83,23.5 15.33,22.5 15.23,24.35 10.18,27.55 3.98,27.3 10.88,7.71 7.02,32.97 34.23,44.35 34.18,50.15 34.43,53.8 41.08,51.25 41.08,47.65 78.18,39.1 74.38,35.9 78.33,34.4 4.76,5.74 9.87,7.7 15.23,6.44 22.79,4.51 28.84,6.63 28.91,2.44 28.47,8.35 35.7,19.32 8.84,15.18 4.39,15.53 5.34,19.23 8.59,19.28 21.49,19.03 13.9,14.9 24.95,14.7 23.8,14.75 25.8,11.65 25.85,8.45 18.38,9.14 13.03,7.19 17.25,14.9 15.45,14.9 13.04,11.58 2.5,13.35 60.65,35.95 73.68,29.3 60.2,27.05 24.76,2.29 37.43,43.65 48.45,24.3 48.65,18.22 48.7,16.32 36.75,30.02 48.9,29.62 39.9,30.02 1.63,20.9 105.43,16.2 49.4,2.9 47,2.9 38.6,7 40.2,7 44.1,8.8 47.1,12.8 48.3,5.9 49.5,5.9 105.43,9.4 105.43,12.8 106.13,2.7 106.13,6.1 102.03,2.6 102.03,6 62.9,35.35 65.7,35.3 63.6,28.55 66.35,29.25 63.8,21.6 65.65,21.6 49.3,36.4 49.3,34.75 46.8,34.9 48.4,26.5 78.33,43.65 74.38,43.65 70.98,43.45 68.13,41.85 85.73,42.5 87.08,46.1 77.88,46.15 74.08,46.55 58.03,56.5 60.53,56.5 54.68,56.45 52.23,56.45 53.48,58.7 59.43,58.45 63.48,58.55 69.7,29.35 61.3,11.87 52.1,26.6 52.2,34.35 60.45,34.35 41.08,44.5 38.93,41.15 36.48,36.8 38.88,36.8 42.13,37.8 43.08,34.95 39.93,26.5 36.78,26.55 36.73,24.35 39.88,24.35 42.63,24.35 51.8,18.17 51.85,15.97 58.1,12.02 60.5,8.97 101.48,30.7 94.88,33.1 87.58,33.65 87.73,28.95 86.68,11.35 77.83,11.25 105.38,55.65 105.43,51.75 105.13,47.65 94.68,42.95 99.58,42.85 90.38,40.75 26.19,6.13 4.81,1.34 8.31,1.39 11.43,2.61 16.88,2.66 25.09,18.68 25.04,22.98 25.04,20.73 12.72,32.82 1.87,32.82 1.32,24.92 22.17,32.77 22.32,28.47 56.25,2 58.8,2 101.48,36.4 94.38,4 86.58,3.9 75.58,57.25 101.63,27.45 75.93,52.7 75.88,54 102.23,48 102.23,46.55 53.7,2 69.03,57.6 87.78,22.55 91.23,46.2 100.48,13.85 99.13,13.85 66.38,4.35 82.28,18.4 84.78,18.45 79.73,18.4 55.4,15.32 55.35,13.97 57.3,15.77 51.73,50.05 51.48,52.7
  pour Bottom: 17.95,60.86 21.05,60.92 24.1,61 109.86,60.96 109.86,0 -1.27,0 -1.3,60.8
  pour Top: -2.25,41.63 -1.85,43.05 -1.8,49.12 -1.65,62.44 24.1,62.4 110.49,62.23 110.49,0 -2.54,0 -2.4,40.55
GPIO_LOOPBACK
  Bottom 0.2: U1.P8_14 U1.P8_13
IN_L
  Bottom 0.305: IN_L.P$3 48.7,4.45 R300.2 45.61,7.18 41.65,7.18 39.82,9.01 | IN_R.P$2 35.77,8.4 36.37,9.01 39.82,9.01 | IC5.3 40.19,12.69 39.73,12.23 39.73,9.1 39.82,9.01
LED1  (via drill 0.3)
  Top 0.254: SW1.PL1 54.25,43.55 55.35,43.55 55.8,43.1 55.8,39.25 56.85,38.2 56.85,30.95 59.4,28.4 59.4,12.1 58.8,11.5 v58.8,7.55
  Bottom 0.254: U1.P8_09 58.8,6.91 v58.8,7.55
LED2  (via drill 0.3)
  Top 0.254: v57.5,7.7 54.8,7.7 53.7,8.8 53.7,12.2 54.55,13.05 54.55,15.84 SW2.PL1
  Bottom 0.254: U1.P8_11 v57.5,7.7
LED3  (via drill 0.3)
  Top 0.254: U1.P8_15 53.53,6.8 60.9,6.8 v61.3,6.4
  Bottom 0.254: v61.3,6.4 61.7,6.8 97.5,6.8 97.7,6.6 99.6,6.6 100.2,7.2 105.2,7.2 106.77,8.77 JP2.1
LED4
  Top 0.254: U1.P8_16 53.67,4.4 63.2,4.4 63.85,3.75 63.85,1.95 64.7,1.1 103.3,1.1 104.2,2 104.2,18.54 JP2.2
LED_PWM
  Bottom 0.254: U1.P9_14 56.15,50.2 57.95,50.2 58.3,49.85 U2.3
LED_PWM_DRIVE  (via drill 0.3)
  Top 0.254: v98,7.4 98.5,7.9 98.5,30.62 JP2.16 | v57.5,8.7 56.65,8.7 56.2,9.15 56.2,16.2 56.3,16.3 | v55.3,16.3 56.3,16.3 | v54.95,42.69 54.95,39.2 56.3,37.85 56.3,30.7 57.3,29.7 57.3,17.3 56.3,16.3
  Bottom 0.254: v98,7.4 61.8,7.45 59.9,7.45 58.65,8.7 v57.5,8.7 | U2.5 59.9,47.3 58.9,46.3 55.8,46.3 54.94,45.44 R3.1 54.94,43.65 v54.95,42.69 | v55.3,16.3 55.3,16.78 R4.1
N$1
  Bottom 0.305: IC5.6 IC5.7 36.31,13.97 37.67,13.97 38,14.3 R11.2
N$2
  Bottom 0.305: IC5.1 | R10.2 39.77,15.55 40.09,15.23 IC5.1 | IC5.1 IC5.2
N$3
  Bottom 0.305: 45.12,34.77 CV_A.P$3 46.5,36.18 46.5,37.6 47.5,38.6 48.25,38.6 48.55,38.3 61.5,38.3 62.1,37.7 65.75,37.7 68.9,40.85 85.25,40.85 87.85,38.3 89.9,38.3 92.05,40.45 92.05,42.53 R501.1
N$4  (via drill 0.3)
  Top 0.254: U1.P9_06 U1.P9_05
  Top 0.305: v93.3,42 93.3,33.7 JP1.2
  Bottom 0.305: U1.P9_06 67.31,49.2 71.9,49.2 73.55,47.55 91.05,47.55 93.3,45.3 v93.3,42
N$5
  Bottom 0.254: SW1.PL2 57.85,42.55 R3.2
N$6  (via drill 0.3)
  Top 0.305: v82.15,41.85 v82.15,31.8
  Bottom 0.254: 66.15,44.2 66.1,44.25
  Bottom 0.305: R700.2 66.1,44.25 R701.2 | R703.1 IC2.9 v82.15,31.8 | 66.15,44.2 67.75,44.2 70.25,41.85 v82.15,41.85
N$7  (via drill 0.3)
  Top 0.204: SJ1.2 55.75,48.25
  Top 0.254: 54.25,48.15 SJ1.2 v54.25,49.4
  Bottom 0.254: U2.2 57.5,48.25 C25.2 56.6,49.3 56.5,49.4 v54.25,49.4
N$8
  Bottom 0.305: 81.35,57.52 Q2.3 | 81.29,57.27 Q2.3 | Q2.3 81.3,57.28 PWR.10 PWR.9
N$9
  Bottom 0.254: R4.2 SW2.PL2
N$10
  Bottom 0.305: R5.2 C8.2 17.45,13.35 16.75,12.65 IC1.1 15.88,12.65 14.25,12.65 13.8,12.2 13.8,6.3 14.35,5.75 17.65,5.75 18.7,6.75 20.75,6.75 21.25,6.3 R7.1
N$11
  Bottom 0.305: IC1.2 17.95,11.38 C8.1 R17.2
N$12
  Bottom 0.305: 96.97,54.98 Q1.3 | 96.97,54.73 Q1.3 | PWR.2 PWR.1 96.98,54.74 Q1.3
N$13  (via drill 0.3)
  Top 0.305: v76.25,46.55 v76.25,38.75
  Bottom 0.305: R501.2 R500.2 90.5,45.8 89.45,46.85 77.4,46.85 77.05,46.55 v76.25,46.55 | IC2.2 77.07,36.96 R503.1 v76.25,38.75
  Bottom 0.406: 76.47,37.76 R503.1
N$14
  Bottom 0.305: POT5.2 R500.1
N$15
  Bottom 0.305: IC1.3 17.98,10.12 18.2,9.9 R18.2
N$16
  Bottom 0.254: 53.64,33.3 53.64,35.06 53.4,35.3 53.16,35.3 D500.3
  Bottom 0.406: 53.64,33.3 arc90 R505.2 R504.1
N$17
  Bottom 0.305: IC2.1 75.8,36.53 R503.2
  Bottom 0.406: 75.8,35.13 IC2.1 75.8,34.8 75.4,34.4 63.8,34.4 62.35,32.95 R504.2
N$19  (via drill 0.3)
  Top 0.305: v66.8,23.6 v66.8,21.8
  Bottom 0.305: R601.1 93.05,17.15 93.55,17.65 93.55,20.35 92.5,21.4 87.63,21.4 86.46,20.23 86.46,18.7 84.91,17.14 71.45,17.14 v66.8,21.8 | CV_B.P$3 45.25,21.9 60.1,21.9 61.8,23.6 v66.8,23.6
N$20  (via drill 0.3)
  Top 0.305: v90.5,19.75 v90.5,36.2 90.5,35.66
  Bottom 0.305: IC2.6 82.15,37.28 R603.1 | v90.5,19.75 R600.2 R601.2 92,18.98 | 81.6,37.75 81.6,38.5 81.9,38.8 84.1,38.8 86.73,36.22 89.98,36.22 v90.5,36.2
  Bottom 0.406: R603.1 81.63,37.78 81.6,37.75
N$21
  Bottom 0.305: POT6.2 R600.1
N$22
  Bottom 0.305: IC2.7 83.42,37.71 R603.2
  Bottom 0.406: IC2.7 83.4,35.54 83.4,34 83.05,33.65 64.4,33.65 62.2,31.45 R604.2
N$23  (via drill 0.3)
  Top 0.254: v59.34,34.75 59.34,32.3 R604.1 v57.64,31.45
  Bottom 0.254: v59.34,34.75 59.3,34.79 D600.3
  Bottom 0.406: R604.1 v57.64,31.45 R605.2
N$24
  Bottom 0.305: R9.2 R18.1 C10.1 R21.2 | R21.2 22.8,9.85 | R21.2 22.8,8.35
N$25
  Bottom 0.254: 45.85,38.1 44.4,38.1
  Bottom 0.305: CV_C.P$3 41.06,34.77 44.4,38.1 | R701.1 66.6,39.85 65.1,38.35 62.4,38.35 61.85,38.9 48.75,38.9 48.45,39.2 47.2,39.2 46.1,38.1 45.85,38.1
N$27
  Bottom 0.305: POT7.2 R700.1
N$28
  Bottom 0.305: IC2.8 83.42,28.71 R703.2
  Bottom 0.406: IC2.8 83.4,30.38 83.4,32.4 82.9,32.9 64.95,32.9 62,29.95 R704.2
N$29  (via drill 0.3)
  Top 0.305: v55.65,27.25 v55.65,29.95
  Bottom 0.305: v55.65,27.25 57.05,27.25 arc-90 D700.3
  Bottom 0.406: R704.1 v55.65,29.95 R705.2
N$30
  Bottom 0.305: R22.2 C15.2 9.21,11.38 IC1.7 12.12,11.38 12.45,11.05 12.45,7.8 11.9,7.25 R23.1
N$31  (via drill 0.3)
  Top 0.305: v49.5,14.1 48.75,14.85 43.55,14.85 42.8,15.6 v42.8,22.23
  Bottom 0.305: 32.38,22 CV_D.P$3 33.51,22.06 33.68,22.23 v42.8,22.23 | R801.1 66.6,14.1 65.25,12.75 50.75,12.75 v49.5,14.1
N$32
  Bottom 0.305: R53.1 R22.1 4.05,12.1 R51.2 C22.1 5.4,10.4
N$33  (via drill 0.3)
  Top 0.305: v77.05,29.1 v77.05,15.85
  Bottom 0.305: IC2.13 77.07,28.7 R803.1 76.83,28.28 77.05,28.5 v77.05,29.1 | 66.6,18.63 R801.2 66.66,18.79 67.96,18.79 70.9,15.85 v77.05,15.85
  Bottom 0.406: R800.2 R801.2
N$34
  Bottom 0.305: POT8.2 R800.1
N$35
  Bottom 0.305: 75.77,30.33 75.77,29.1 R803.2
  Bottom 0.406: 75.77,30.33 IC2.14 75.8,31.75 75.4,32.15 65.5,32.15 61.8,28.45 R804.2
N$36
  Bottom 0.305: R805.2 53.7,28.16 53.7,27.3 53.56,27.16 D800.3
  Bottom 0.406: R804.1 R805.2
N$37
  Bottom 0.254: Q901.1 R904.2 48.3,55 R905.2
N$38
  Bottom 0.305: T1.1 30.1,50.55 R43.2
N$40
  Bottom 0.305: IC1.6 8.66,10.12 C15.1 R53.2
N$41
  Bottom 0.305: C14.1 R17.1 R5.1 R16.2 22.8,13.3 22.8,11.75 22.8,11.6
N$42
  Bottom 0.305: IC1.5 7.2,8.85 R54.2
N$43
  Bottom 0.305: C21.1 R55.2 R54.1 R52.2 | C21.1 4,8.7 | 4,7.15 C21.1
N$44
  Bottom 0.305: R46.2 R44.1 34.5,52 34.3,51.8 34.1,51.8 T1.3
N$45
  Bottom 0.254: R25.2 Q3.1 R24.2
N$46
  Bottom 0.254: R904.1 TR_IN_1.P$3
N$47
  Bottom 0.254: TR_IN_2.P$3 46.78,47.47 R24.1
N$48  (via drill 0.3)
  Top 0.305: v32.4,7.6 28.36,7.6 27.46,6.7 IN_R.P$3
  Bottom 0.305: 27.5,4.48 IN_R.P$3 27.46,2.62 R13.2 | IC5.5 36.3,10.21 35.09,8.99 33.8,8.99 v32.4,7.6
N$49
  Bottom 0.305: 17.28,26.15 IC6.14 17.19,26.8 | R27.1 17.19,26.8 | R29.2 C16.2 16.65,28.95 17.19,28.41 17.19,26.8
N$50  (via drill 0.3)
  Top 0.305: v27.55,27.25 27.3,27 27.3,10.45 28,9.75 44.51,9.75 v46.71,7.65
  Bottom 0.305: 21.7,24.45 R28.1 | R29.1 C16.1 14.95,29.25 15.92,28.28 IC6.13 15.95,26.03 15.95,24.75 16.25,24.45 17.85,24.45 18.8,23.5 20.85,23.5 R28.1 | v46.71,7.65 R30.1 | v27.55,27.25 22.9,27.25 21.75,26.1 R28.1
N$51
  Bottom 0.305: R27.2 20.05,25.6 DAC1.P$3
N$52
  Bottom 0.305: IC6.1 R33.2 C18.2 20.25,20.7 21.4,20.7 R31.1
N$53  (via drill 0.3)
  Top 0.305: v28.25,21.5 27.95,21.2 27.95,10.75 28.35,10.35 45.4,10.35 48.21,7.54 v49.09,7.54 arc90 v49.1,7.55
  Bottom 0.305: 21.7,22.55 R32.1 | IC6.2 15.95,20.89 15.95,22.2 16.3,22.55 R33.1 C18.1 20.25,22.5 R32.1 | v49.1,7.55 R34.1 | R32.1 21.75,21.85 22.1,21.5 v28.25,21.5
N$54
  Bottom 0.305: R31.2 23.45,18.3 DAC2.P$3
N$55
  Bottom 0.305: IC6.8 9.48,26.15 R37.2 C19.2 6.35,26.1 R35.1
N$56  (via drill 0.3)
  Top 0.305: v10.84,24.45 11.6,23.69 11.6,21.8 11,21.2 5.05,21.2 3.45,19.6 3.45,16.75 1.15,14.45 1.15,8.1 1.9,7.35 8.75,7.35 10.05,6.05 10.05,2 10.8,1.25 33.85,1.25 34.8,2.2 49.9,2.2 51.15,3.45 v51.15,6.25
  Bottom 0.305: R36.1 6.35,24.4 C19.1 R37.1 v10.84,24.45 IC6.9 | R38.1 51,6.15 v51.15,6.25
N$57
  Bottom 0.305: DAC3.P$3 2.06,27.18 R35.2
N$58
  Bottom 0.305: IC6.7 R41.2 C20.2 6.25,20.9 R39.1
N$59  (via drill 0.3)
  Top 0.305: v10.85,22.55 1.75,22.55 0.5,21.3 0.5,7.75 1.55,6.7 8.4,6.7 9.4,5.7 9.4,1.75 10.5,0.65 34.15,0.65 35.1,1.6 50.3,1.6 50.5,1.8 v50.9,1.8
  Bottom 0.305: R40.1 6.25,22.5 C20.1 R41.1 v10.85,22.55 IC6.6 | R42.1 54.85,7.55 53.7,6.4 53.7,4.9 53.2,4.4 51.8,4.4 50.9,3.5 v50.9,1.8
N$60
  Bottom 0.305: DAC4.P$3 2.06,19.82 R39.2
N$61
  Bottom 0.305: R44.2 R45.2 37.3,53.65 TR_OUT_1.P$3
N$62
  Bottom 0.305: T2.1 36.95,40.3 R47.2
N$63
  Bottom 0.305: R50.2 R48.1 36,45.25 T2.3
N$64
  Bottom 0.305: R48.2 R49.2 32.4,47.45 TR_OUT_2.P$3
N$65
  Top 0.305: X1.D+ 5.51,50.09 2.9,52.7 2.21,52.7 USBD.4
N$66
  Top 0.305: X1.GND 5.45,47.6 2.95,45.1 2.21,45.1 USBD.1
N$67
  Bottom 0.305: X1.VBUS 16.03,47.58 14.45,46 11.89,46 10.24,47.65 5.83,47.65 USBD.2
N$68
  Bottom 0.305: X1.D- 16.03,50.17 14.6,51.6 11.74,51.6 10.34,50.2 5.83,50.2 USBD.3
OUT_L
  Bottom 0.305: OUT_L.P$3 24.61,6.2 R7.2
OUT_R
  Bottom 0.254: OUT_R.P$3
  Bottom 0.305: R23.2 10.2,5.1 10.85,4.45 OUT_R.P$3
SW1_GPIO
  Top 0.254: U1.P9_12 59.6,49.29 59.6,41.25 58.35,40.01 SW1.P4
  Bottom 0.254: SW1.P3 53.27,39.98 R1.1 55.91,40.01 SW1.P4
TR_IN_1  (via drill 0.3)
  Top 0.254: v40.6,40.2 40.55,18.6 39.95,18 37.15,18 34.05,14.9 31.35,14.9 30.85,14.4 v30.85,11.2
  Bottom 0.254: 49.4,49.85 49.25,49.7 Q901.3 | 48.95,49.9 Q901.3 | R906.1 44.95,48.95 | 44.95,48.95 47.8,48.95 48.45,49.6 Q901.3 | 44.95,48.95 43.75,48.95 42.65,47.85 42.65,40.85 42,40.2 v40.6,40.2 | v30.85,11.2 30.85,6.65 29.85,5.65 29.85,3.3 31.25,1.9 JP4.3
TR_IN_2  (via drill 0.3)
  Top 0.254: v33.7,6.9 34.7,7.9 44.9,7.9 46,6.8 50,6.8 51.2,8 v51.2,14.6 50.9,14.9 50.9,38.25 50.4,38.75 v50.4,45.5
  Bottom 0.254: v33.7,6.9 34.56,6.9 JP4.4 | SW2.P3 51.7,14.61 v51.2,14.6 | Q3.3 50.4,46.4 v50.4,45.5 50.4,44.65 R26.1
  Bottom 0.305: SW2.P3 SW2.P4
TR_IN_3
  Top 0.254: JP2.11 108.6,29.44 108.6,1.5 107.6,0.5 63.2,0.5 62.6,1.1 62.6,3.11 U1.P8_08
TR_IN_4  (via drill 0.3)
  Top 0.254: v99.8,2 99.8,26.84 JP2.12
  Bottom 0.254: v99.8,2 99.3,2 99,1.7 61.47,1.7 U1.P8_10
TR_OUT_1  (via drill 0.3)
  Top 0.254: U1.P8_07 63.85,6.96 63.85,12.35 64.65,13.15 64.65,46.45 68.95,50.75 68.95,54.55 65.85,57.65 31.15,57.65 30.15,56.65 30.15,53.3 v29.2,52.35
  Bottom 0.254: v29.2,52.35 R43.1
TR_OUT_2  (via drill 0.3)
  Top 0.254: v50.4,12.1 50.4,38 48.1,40.3 v43.75,40.3
  Bottom 0.254: R47.1 35.15,39.3 35.45,39 42.45,39 v43.75,40.3 | U1.P8_12 56.2,4.43 56.2,11.5 55.6,12.1 v50.4,12.1
TR_OUT_3
  Bottom 0.254: JP2.13 108.01,32.57 108.01,1.61 107.51,1.11 43.81,1.11 42.88,2.04 42.88,5.55 42.43,6 37.21,6 37.18,5.97 JP4.2
TR_OUT_4
  Bottom 0.254: JP2.14 104.23,33.83 105.5,35.1 107.5,35.1 108.55,34.05 108.55,1.38 107.7,0.53 43.53,0.53 42.17,1.89 JP4.1

### Text on the board
tPlace: BelaCore Rev03 | Rebel Technology
bPlace: -12V | BelaCore Rev03 | Rebel Technology
bNames: G | W | R | B